# EAGLE design five_poke_1_0 (EAGLE 6.5.0)
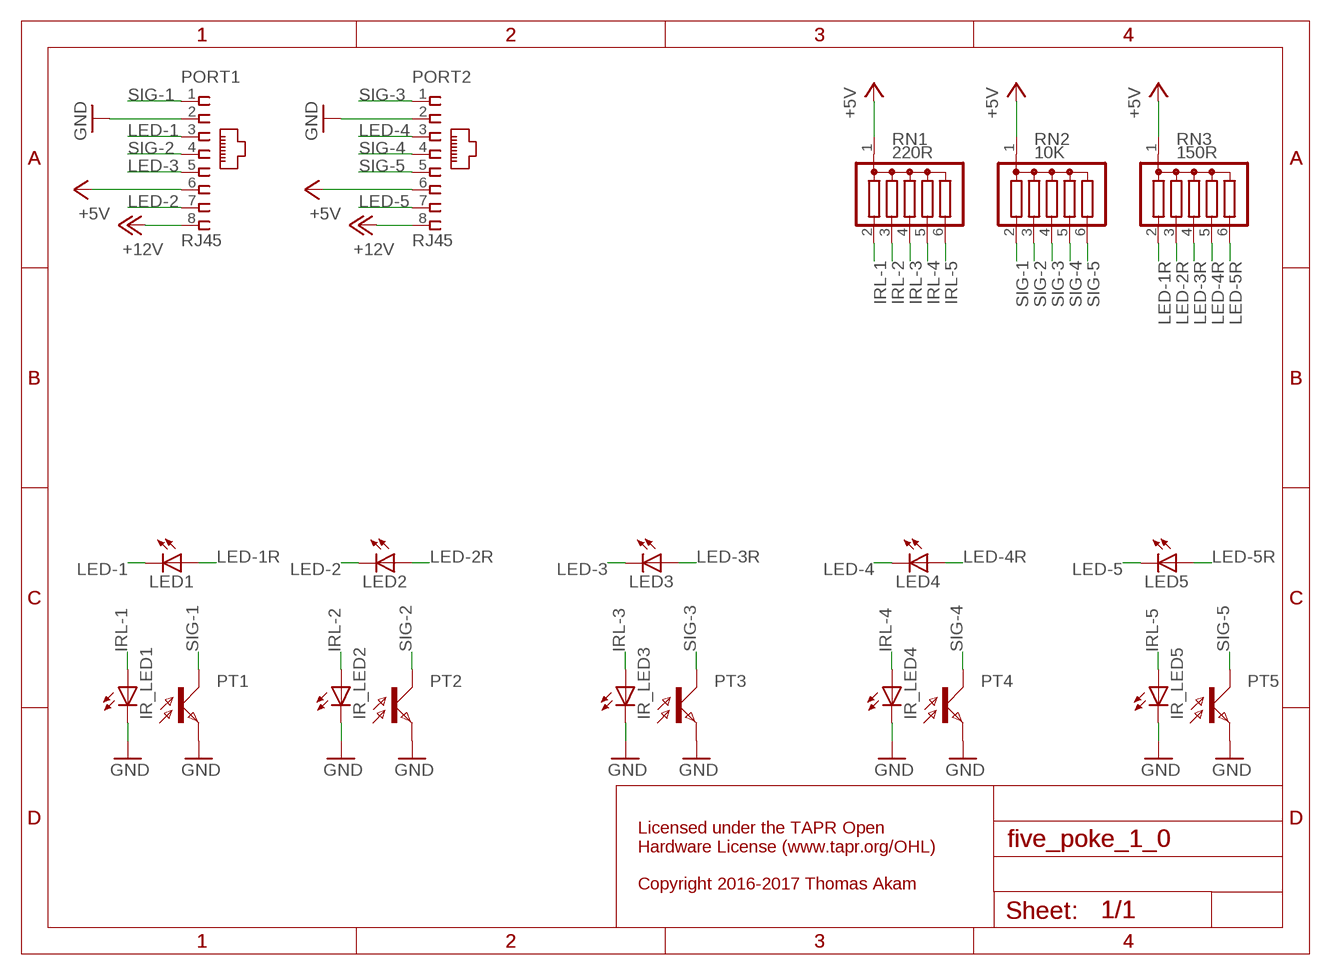
[diagram p0: schematic, sheet 1]

## Parts
IR_LED1  LEDIRL80A  [IRL80A]
IR_LED2  LEDIRL80A  [IRL80A]
IR_LED3  LEDIRL80A  [IRL80A]
IR_LED4  LEDIRL80A  [IRL80A]
IR_LED5  LEDIRL80A  [IRL80A]
LED1  LEDSML0805  [SML0805]
LED2  LEDSML0805  [SML0805]
LED3  LEDSML0805  [SML0805]
LED4  LEDSML0805  [SML0805]
LED5  LEDSML0805  [SML0805]
PORT1  RJ45  RJ45VERTICAL  [RJ45-NO-SHIELD-VERTICAL]
PORT2  RJ45  RJ45VERTICAL  [RJ45-NO-SHIELD-VERTICAL]
PT1  LPT80A  [LPT80A]
PT2  LPT80A  [LPT80A]
PT3  LPT80A  [LPT80A]
PT4  LPT80A  [LPT80A]
PT5  LPT80A  [LPT80A]
RN1  220R  G05R  [SIL6]
RN2  10K  G05R  [SIL6]
RN3  150R  G05R  [SIL6]

## Nets
+5V: PORT1.6 PORT2.6 RN1.1 RN2.1 RN3.1
+12V: PORT1.8 PORT2.8
GND: IR_LED1.K(C) IR_LED2.K(C) IR_LED3.K(C) IR_LED4.K(C) IR_LED5.K(C) PORT1.2 PORT2.2 PT1.E PT2.E PT3.E PT4.E PT5.E
IRL-1: IR_LED1.A RN1.2
IRL-2: IR_LED2.A RN1.3
IRL-3: IR_LED3.A RN1.4
IRL-4: IR_LED4.A RN1.5
IRL-5: IR_LED5.A RN1.6
LED-1: LED1.C PORT1.3
LED-1R: LED1.A RN3.2
LED-2: LED2.C PORT1.7
LED-2R: LED2.A RN3.3
LED-3: LED3.C PORT1.5
LED-3R: LED3.A RN3.4
LED-4: LED4.C PORT2.3
LED-4R: LED4.A RN3.5
LED-5: LED5.C PORT2.7
LED-5R: LED5.A RN3.6
SIG-1: PORT1.1 PT1.C RN2.2
SIG-2: PORT1.4 PT2.C RN2.3
SIG-3: PORT2.1 PT3.C RN2.4
SIG-4: PORT2.4 PT4.C RN2.5
SIG-5: PORT2.5 PT5.C RN2.6

## Notes on the sheet
- Licensed under the TAPR Open
  Hardware License (www.tapr.org/OHL)
  
  Copyright 2016-2017 Thomas Akam

## Library data of the parts
IR_LED1-IR_LED5 LED1-LED5 = led:LED: LED OSRAM: - CHIPLED LG R971, LG N971, LY N971, LG Q971, LY Q971, LO R971, LY R971 LH N974, LH R974 LS Q976, LO Q976, LY Q976 LO Q996 - Hyper CHIPLED LW Q18S LB Q993, LB Q99A, LB R99A - SideLED LS A670, LO A670, LY A670, LG A670, LP A670 LB A673, LV A673, LT A673, LW A673 LH A674 LY A675 LS A676, LA A676, LO A676, LY A676, LW A676 LS A679, LY A679, LG A679 - Hyper Micro SIDELED® LS Y876, LA Y876, LO Y876, LY Y876 LT Y87S - SmartLED LW L88C, LW L88S LB L89C, LB L89S, LG L890 LS L89K, LO L89K, LY L89K LS L896, LA L896, LO L896, LY L896 - TOPLED LS T670, LO T670, LY T670, LG T670, LP T670 LSG T670, LSP T670, LSY T670, LOP T670, LYG T670 LG T671, LOG T671, LSG T671 LB T673, LV T673, LT T673, LW T673 LH T674 LS T676, LA T676, LO T676, LY T676, LB T676, LH T676, LSB T676, LW T676 LB T67C, LV T67C, LT T67C, LS T67K, LO T67K, LY T67K, LW E67C LS E67B, LA E67B, LO E67B, LY E67B, LB E67C, LV E67C, LT E67C LW T67C LS T679, LY T679, LG T679 LS T770, LO T770, LY T770, LG T770, LP T770 LB T773, LV T773, LT T773, LW T773 LH T774 LS E675, LA E675, LY E675, LS T675 LS T776, LA T776, LO T776, LY T776, LB T776 LHGB T686 LT T68C, LB T68C - Hyper Mini TOPLED® LB M676 - Mini TOPLED Santana® LG M470 LS M47K, LO M47K, LY M47K Source: http://www.osram.convergy.de LUXEON: - LUMILED® LXK2-PW12-R00, LXK2-PW12-S00, LXK2-PW14-U00, LXK2-PW14-V00 LXK2-PM12-R00, LXK2-PM12-S00, LXK2-PM14-U00 LXK2-PE12-Q00, LXK2-PE12-R00, LXK2-PE12-S00, LXK2-PE14-T00, LXK2-PE14-U00 LXK2-PB12-K00, LXK2-PB12-L00, LXK2-PB12-M00, LXK2-PB14-N00, LXK2-PB14-P00, LXK2-PB14-Q00 LXK2-PR12-L00, LXK2-PR12-M00, LXK2-PR14-Q00, LXK2-PR14-R00 LXK2-PD12-Q00, LXK2-PD12-R00, LXK2-PD12-S00 LXK2-PH12-R00, LXK2-PH12-S00 LXK2-PL12-P00, LXK2-PL12-Q00, LXK2-PL12-R00 Source: www.luxeon.com KINGBRIGHT: KA-3528ASYC Source: www.kingbright.com
PORT1 PORT2 = con-tycoelectronics-vertical_RJ45:RJ45: CORCOM Modular RJ Jacks No Shield Source: www.tycoelectronics.com .. ENG_DS_1654001_1099_RJ_L_0507.pdf
PT1-PT5 = opto-trans-siemens:LPT80A: PHOTO TRANSISTOR; OC_FARNELL: unknown; OC_NEWARK: unknown
RN1-RN3 = resistor-sil:G05R: SIL RESISTOR; OC_FARNELL: unknown; OC_NEWARK: unknown

## Board
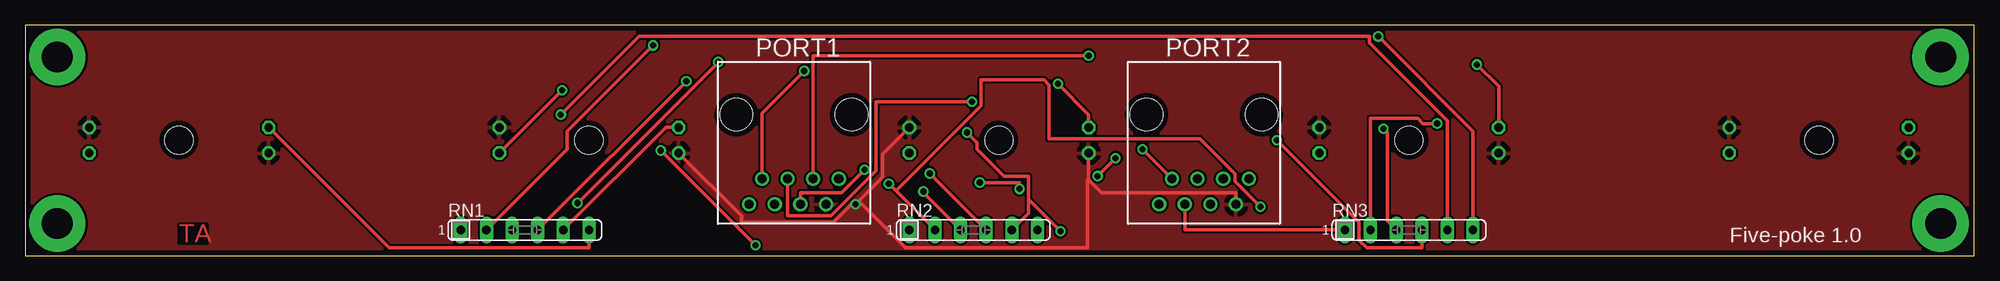
[diagram p1: board, top side]
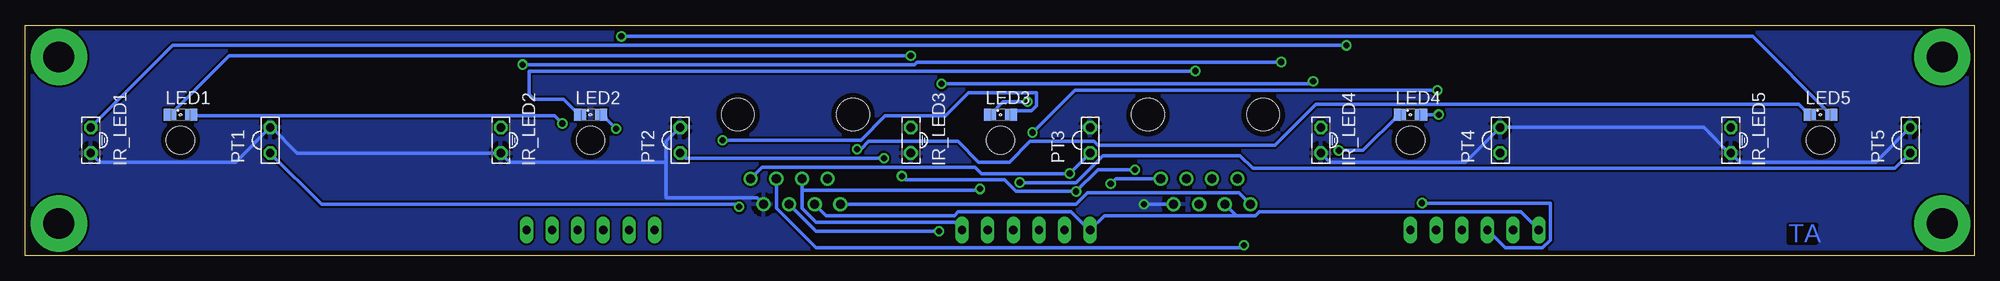
[diagram p2: board, bottom side, seen from below]

Size 193.19 x 22.82 mm. Coordinates in mm from the lower left corner, seen from the top.
Outline: 0,0 193.19,0 193.19,22.82 0,22.82 0,0
Copper layers (1*16): Top 0.035mm / dielectric 1.5mm / Bottom 0.035mm
Design rules "default *": minimum track width 14mil, minimum drill 24mil, track to track 8mil, track to pad 8mil, pad to pad 8mil, via to via 8mil, smd to smd 8mil, copper to edge 20mil, drill to drill 8mil, minimum pad ring 10mil, minimum via ring 8mil, stop-mask expansion 4mil, vias tented up to drill 0mil, thermal gap 20mil
Holes 2.8 mm at 177.8,11.43 137.16,11.43 96.52,11.43 55.88,11.43 15.24,11.43
vRestrict: area 72.4,19.1 to 80.6,21.6; area 112.4,19.1 to 121.9,21.6; area 48.9,3.8 to 53.3,5.1; area 93.3,3.8 to 96.5,5.1; area 136.5,3.8 to 141,5.1

### Footprints (pad centres in the part's own frame; a part is rotated, then mirrored left to right if it is on the bottom)
IRL80A = drill 0.813 octagon: A 0,-1.27; K 0,1.27
SML0805 = smd 1.2 x 1.2: A 1.05,0; C -1.05,0
RJ45-NO-SHIELD-VERTICAL = drill 0.9 pad 1.4: 1 -4.445,5.08; 2 -3.175,7.62; 3 -1.905,5.08; 4 -0.635,7.62; 5 0.635,5.08; 6 1.905,7.62; 7 3.175,5.08; 8 4.445,7.62 | hole 3.251: -5.715,-1.27; 5.715,-1.27
LPT80A = drill 0.813 octagon: C 0,-1.27; E 0,1.27
SIL6 = drill 0.813 long: 1 -6.35,0; 2 -3.81,0; 3 -1.27,0; 4 1.27,0; 5 3.81,0; 6 6.35,0

### Placement (x,y rotation side)
IR_LED1  186.69,11.43 180 bottom
IR_LED2  146.05,11.43 180 bottom
IR_LED3  105.41,11.43 180 bottom
IR_LED4  64.77,11.43 180 bottom
IR_LED5  24.13,11.43 180 bottom
LED1  177.8,13.97 0 bottom
LED2  137.16,13.97 0 bottom
LED3  96.52,13.97 0 bottom
LED4  55.88,13.97 0 bottom
LED5  15.24,13.97 0 bottom
PORT1  76.2,12.7 180 top
PORT2  116.84,12.7 180 top
PT1  168.91,11.43 0 bottom
PT2  128.27,11.43 0 bottom
PT3  87.63,11.43 0 bottom
PT4  46.99,11.43 0 bottom
PT5  6.35,11.43 0 bottom
RN1  49.53,2.54 0 top
RN2  93.98,2.54 0 top
RN3  137.16,2.54 0 top

### Tracks (layer width: path | path; a pad name or v marks a point on that pad's centre or on a via)
+5V
  Top 0.356: RN3.1 114.94,2.54 PORT2.6
  Bottom 0.356: RN1.1 44.96,4.32 70.87,4.32 71.25,3.94 73.15,3.94 | PORT1.6 73.15,3.94 | 73.15,3.94 86.23,3.94 RN2.1 87.76,2.54 89.53,4.32 100.71,4.32 101.09,3.94 113.79,3.94 PORT2.6
+12V
  Bottom 0.356: PORT1.8 72.9,6.22 87.88,6.22 89.03,5.08 PORT2.8
GND  (via drill 0.61)
  Top 0.356: PT3.E 84.96,10.03 84.96,7.75 v82.3,5.08 | v82.3,5.08 81.92,5.08 80.14,3.3 70.99,3.3 70.99,3.94 IR_LED4.K | 105.41,7.49 IR_LED3.K | 105.41,7.49 106.68,6.22 120.02,6.22 PORT2.2 | v82.3,5.08 82.68,5.33 87.25,0.76 105.28,0.76 105.28,7.49 105.41,7.49
  Bottom 0.356: PT5.E 9.78,9.27 23.24,9.27 IR_LED5.K 24.26,10.16 26.8,12.7 PT4.E 50.42,9.27 63.88,9.27 IR_LED4.K | PORT1.2 v82.3,5.08 | IR_LED1.K 185.8,9.27 172.34,9.27 PT1.E 168.78,12.7 166.24,10.16 IR_LED2.K 145.16,9.27 129.67,9.27 | PT2.E 129.67,11.3 129.67,9.27 | 129.67,9.27 129.67,5.71 120.65,5.71 PORT2.2
  pour Bottom: 0,0 0,22.86 193.04,22.86 193.04,0
  pour Top: 0,0 193.04,0 193.04,22.86 0,22.86
IRL-1  (via drill 0.61)
  Top 0.356: RN1.2 53.72,10.54 53.72,12.32 v62.23,20.83
  Bottom 0.356: v62.23,20.83 178.56,20.83 IR_LED1.A
IRL-2  (via drill 0.61)
  Top 0.356: v68.71,19.18 v54.74,5.21 | v143.89,18.92 146.05,16.76 IR_LED2.A
  Bottom 0.356: RN1.3 46.48,0.76 42.8,0.76 42.04,1.52 42.04,5.21 v54.74,5.21 | v68.71,19.18 104.78,19.18 105.03,18.92 v143.89,18.92
IRL-3  (via drill 0.61)
  Top 0.356: v65.53,17.27 RN1.4 | v102.36,17.02 105.41,13.97 IR_LED3.A
  Bottom 0.356: v65.53,17.27 65.79,17.02 v102.36,17.02
IRL-4
  Top 0.356: RN1.5 63.5,12.7 IR_LED4.A
IRL-5
  Top 0.356: IR_LED5.A 36.07,0.76 55.88,0.76 RN1.6
LED-1  (via drill 0.61)
  Top 0.356: v105.41,19.81 78.11,19.81 PORT1.3
  Bottom 0.356: v105.41,19.81 172.97,19.81 178.82,13.97 LED1.C
LED-1R  (via drill 0.61)
  Top 0.356: v139.95,13.08 138.56,13.08 138.05,13.59 133.35,13.59 RN3.2
  Bottom 0.356: v139.95,13.08 140.72,13.84 176.53,13.84 176.66,13.97 LED1.A
LED-2  (via drill 0.61)
  Top 0.356: v77.22,18.29 73.03,14.1 PORT1.7
  Bottom 0.356: v77.22,18.29 143.26,18.29 143.26,16 142.75,15.49 139.83,15.49 138.3,13.97 LED2.C
LED-2R  (via drill 0.61)
  Top 0.356: v134.62,12.57 135,12.19 135,3.43 RN3.3
  Bottom 0.356: v134.62,12.57 136.02,13.97 LED2.A
LED-3  (via drill 0.61)
  Top 0.356: v93.85,15.24 84.33,15.24 84.33,8.38 79.88,3.94 75.56,3.94 PORT1.5
  Bottom 0.356: v93.85,15.24 96.27,15.24 97.54,13.97 LED3.C
LED-3R  (via drill 0.61)
  Top 0.356: v124.08,11.43 132.21,3.3 132.21,1.52 132.97,0.76 138.43,0.76 RN3.4
  Bottom 0.356: v124.08,11.43 110.36,11.43 107.95,13.84 101.98,13.84 99.69,16.13 92.96,16.13 92.96,14.86 93.47,14.35 95,14.35 95.38,13.97 LED3.A
LED-4  (via drill 0.61)
  Top 0.356: v72.39,1.02 v62.99,10.41
  Bottom 0.356: v62.99,10.41 60.58,10.41 57.02,13.97 LED4.C | v72.39,1.02 72.64,0.76 114.81,0.76 118.75,4.7 PORT2.3
LED-4R  (via drill 0.61)
  Top 0.356: v53.09,13.97 60.83,21.72 133.22,21.72 133.22,21.08 140.97,13.34 RN3.5
  Bottom 0.356: v53.09,13.97 LED4.A
LED-5  (via drill 0.61)
  Top 0.356: PORT2.7 v110.74,10.54
  Bottom 0.356: v110.74,10.54 110.36,10.54 109.6,11.3 100.71,11.3 98.68,9.27 95.63,9.27 93.6,11.3 87.25,11.3 86.87,10.92 69.34,10.92 65.28,14.99 17.4,14.99 16.38,13.97 LED5.C
LED-5R  (via drill 0.61)
  Top 0.356: v134.11,21.72 143.51,12.32 RN3.6
  Bottom 0.356: v134.11,21.72 21.97,21.72 14.22,13.97 LED5.A
N$1  (via drill 3.05 pad 5.59)
  other vias: 189.87,19.68
N$2  (via drill 3.05 pad 5.59)
  other vias: 3.17,3.17
N$3  (via drill 3.05 pad 5.59)
  other vias: 3.17,19.68
N$4  (via drill 3.05 pad 5.59)
  other vias: 189.87,3.17
SIG-1  (via drill 0.61)
  Top 0.356: v85.6,7.11 86.3,6.41 | 86.3,6.41 RN2.2 | v122.43,4.83 119.89,7.37 119.89,8.13 116.46,11.56 101.47,11.56 101.47,16.89 100.97,17.4 94.74,17.4 94.74,14.86 86.3,6.41
  Bottom 0.356: v85.6,7.11 85.09,7.62 PORT1.1 | PT1.C 163.83,5.08 122.68,5.08 v122.43,4.83
SIG-2  (via drill 0.61)
  Top 0.356: RN2.3 89.03,6.22 v89.03,6.35 | v83.19,8.51 80.9,6.22 76.83,6.22 PORT1.4 | v106.3,7.87 v108.08,9.65
  Bottom 0.356: v83.19,8.51 86.87,8.51 v89.03,6.35 95,6.35 96.14,7.49 105.92,7.49 v106.3,7.87 | PT2.C 127.76,9.65 v108.08,9.65
SIG-3  (via drill 0.61)
  Top 0.356: RN2.4 v89.66,8.13
  Bottom 0.356: PT3.C v89.66,8.13 98.42,8.13 99.06,8.76 120.14,8.76 PORT2.1
SIG-4  (via drill 0.61)
  Top 0.356: v53.21,16.38 PT4.C | v93.34,12.19 94.36,11.18 94.36,10.54 97.03,7.87 99.44,7.87 99.44,5.46 | 99.44,5.46 99.44,4.19 RN2.5 | v102.62,2.41 99.57,5.46 99.44,5.46
  Bottom 0.356: v53.21,16.38 89.15,16.38 v93.34,12.19 | PORT2.4 114.81,2.41 v102.62,2.41
SIG-5  (via drill 0.61)
  Top 0.356: v94.61,7.24 98.55,7.24 v98.55,6.6
  Bottom 0.356: RN2.6 101.09,3.3 114.81,3.3 116.2,4.7 116.2,6.48 | PORT2.5 116.2,6.48 | PT5.C 7.87,8.64 71.5,8.64 72.77,9.91 86.36,9.91 89.03,7.24 v94.61,7.24 | v98.55,6.6 98.68,6.48 116.2,6.48

### Text on the board
Top: TA
Bottom: TA
tPlace: Five-poke 1.0 | Licensed under the TAPR Open / Hardware License (www.tapr.org/OHL) / / Copyright 2016-2017 Thomas Akam